# Altium schematic sheet SY8105ADC.SchDoc
size A4
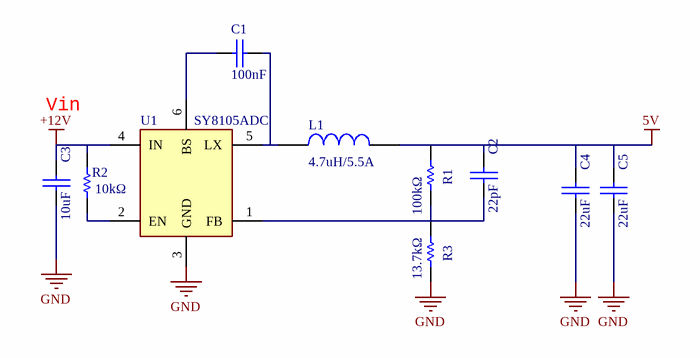
[diagram p0: SY8105ADC.SchDoc]

## Parts
C1  100nF  [C_0402]
C2  22pF  [C_0402]
C3  10uF  [C_0805]
C4  22uF  [C_0805]
C5  22uF  [C_0805]
L1  4.7uH/5.5A  [Ind-SMD_7.3x6.6]
R1  100kΩ  [R_0402]
R2  10kΩ  [R_0402]
R3  13.7kΩ  [R_0402]
U1  SY8105ADC  [SOT23-6]

## Nets
5V: C2.1 C4.1 C5.1 L1.2 R1.1
+12V: C3.1 R2.2 U1.4(IN)
GND: C3.2 C4.2 C5.2 R3.2 U1.3(GND)
NetC1_1: C1.1 L1.1 U1.5(LX)
NetC1_2: C1.2 U1.6(BS)
NetC2_2: C2.2 R1.2 R3.1 U1.1(FB)
NetR2_1: R2.1 U1.2(EN)

## Notes on the sheet
- Vin

## Library data of the parts
C1-C5 = Cap_Chip: 贴片电容; Manufacturer_Name: *; Manufacturer_Part_Number: *
L1 = Ind_Molded: 一体成型功率电感; Manufacturer_Name: Sunltech(韩国顺磁); Manufacturer_Part_Number: SLO0630H4R7MTT; LCSC: C207840
R1-R3 = Res_Chip: 贴片电阻; Manufacturer_Name: *; Manufacturer_Part_Number: *
U1 = SY8105ADC: DC-DC芯片; Manufacturer_Name: Silergy; Manufacturer_Part_Number_1: SY8104ADC; Manufacturer_Part_Number: SY8105ADC; ComponentLink1Description: LCSC; ComponentLink1URL: https://item.szlcsc.com/208856.html; Manufacturer_Name_1: Silergy